# Altium schematic sheet Power.SchDoc
size A; SheetNumber: 3; SheetTotal: 7
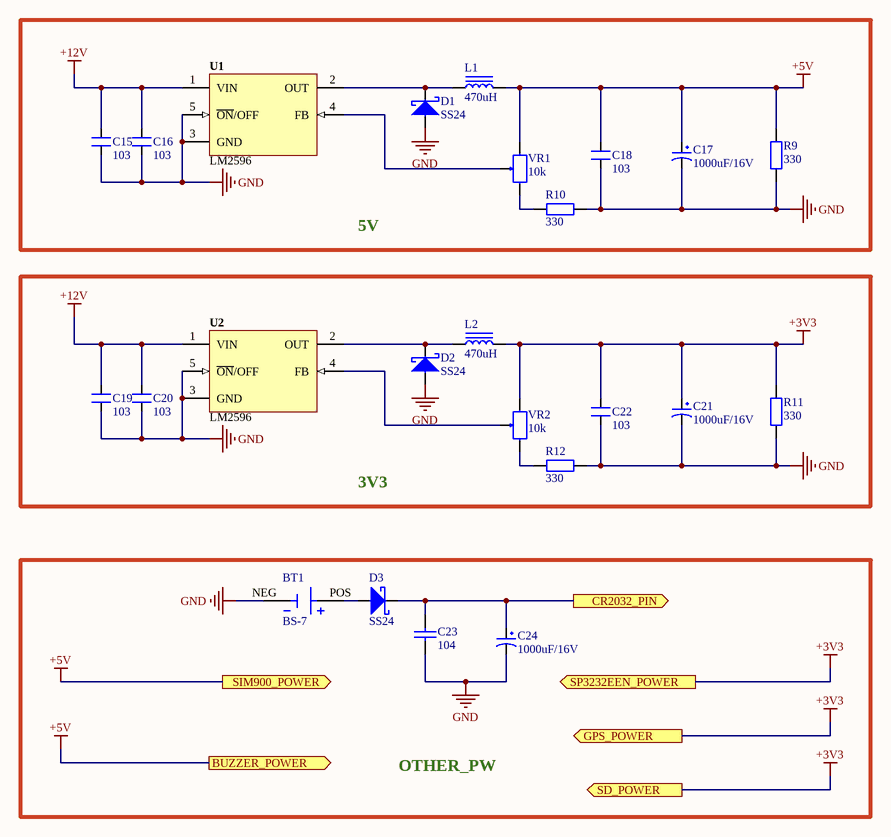
[diagram p0: Power.SchDoc]

## Parts
BT1  BS-7  [BAT_BS-7]
C15  103  [SM-0805]
C16  103  [SM-0603]
C17  1000uF/16V  [CP1.5/3.4]
C18  103  [SM-0603]
C19  103  [SM-0805]
C20  103  [SM-0603]
C21  1000uF/16V  [CP1.5/3.4]
C22  103  [SM-0603]
C23  104  [0805]
C24  1000uF/16V  [CP1.5/3.4]
D1  SS24  [DIO-SMD-106]
D2  SS24  [DIO-SMD-106]
D3  SS24  [DIO-SMD-106]
L1  470uH  [BOURNS SRR1280]
L2  470uH  [BOURNS SRR1280]
R9  330  [RES-1/4W]
R10  330  [RES-1/4W]
R11  330  [RES-1/4W]
R12  330  [RES-1/4W]
U1  LM2596  [TO263]
U2  LM2596  [TO263]
VR1  10k  [VR-S3]
VR2  10k  [VR-S3]

## Blocks framed on the sheet
5V: C15-C18 D1 L1 R9 R10 U1 VR1
3V3: C19-C22 D2 L2 R11 R12 U2 VR2
OTHER_PW: BT1 C23 C24 D3

## Ports
BUZZER_POWER (out), CR2032_PIN (out), GPS_POWER (out), SD_POWER (out), SIM900_POWER (out), SP3232EEN_POWER (out)

## Nets
+3V3: C21.1 C22.2 L2.2 R11.2 VR2.3 ; port SP3232EEN_POWER, port GPS_POWER, port SD_POWER
+5V: C17.1 C18.2 L1.2 R9.2 VR1.3 ; port SIM900_POWER, port BUZZER_POWER
+12V: C15.2 C16.2 C19.2 C20.2 U1.1(VIN) U2.1(VIN)
GND: BT1.NEG C15.1 C16.1 C17.2 C18.1 C19.1 C20.1 C21.2 C22.1 C23.1 C24.2 D1.1 D2.1 R9.1 R10.1 R11.1 R12.1 U1.3(GND) U1.5(~{ON}/OFF) U2.3(GND) U2.5(~{ON}/OFF)
CR2032_PIN: C23.2 C24.1 D3.2 ; port CR2032_PIN
NetBT1_POS: BT1.POS D3.1
NetD1_2: D1.2 L1.1 U1.2(OUT)
NetD2_2: D2.2 L2.1 U2.2(OUT)
NetR10_2: R10.2 VR1.1
NetR12_2: R12.2 VR2.1
NetU1_4: U1.4(FB) VR1.2
NetU2_4: U2.4(FB) VR2.2

## Library data of the parts
BT1 = BS-7: Battery Holder (Open) Coin, 20.0mm 1 Cell PC Pin; MF: MPD (Memory; SnapEDA_Link: https://www.snapeda.com/parts/BS-7/MPD+%2528Memory+Protection+Devices%2529/view-part/?ref=snap; Package: None; MP: BS-7; Check_prices: https://www.snapeda.com/parts/BS-7/MPD+%2528Memory+Protection+Devices%2529/view-part/?ref=eda; Purchase-URL: https://pricing.snapeda.com/search/part/BS-7/?ref=eda; Digi-Key_Part_Number: BS-7-ND; Value: *
C15 C16 C18-C20 C22 = CM: Cap SMD; Value: 103
C17 C21 C24 = CP4: Cap 1000uF/16V - 220uF/50V; Description 5: 4,7uF>10uF/250V_3,3uF>10uF/400V - 2,2uF>4,7uF/450V; Description 1: 2200uF-3300uF/6,3V - 1000uF-2200uF/10V; Description 2: 1000uF/16V - 470uF => 1000uF/25V - 100uF/100V; Description 3: 330uF>470uF/35V_220uF>470uF/50V_10uF>22uF/250V; Description 4: 220uF => 330uF/63V - 10uF =>33uF/160 - 200V; Value: 1000uF/16V
C23 = Cap 104_SMD: Capacitor (Semiconductor SIM Model); Value: 0.1uF; Published: 8-Jun-2000; LatestRevisionDate: 17-Jul-2002; LatestRevisionNote: Re-released for DXP Platform.; PackageReference: C1206; Publisher: Altium Limited
D1-D3 = Diode Schottky: Part Number: LED 3 ly Single Colour; Pricing: *
L1 L2 = Inductor: SMT Inductor; Value: 1.5uH
R9-R12 = R: Resistor R1/4W
U1 U2 = LM2596: Max Input Voltage: 12 V; Max Output Current: 3 (6.0 peak) A; Max Output Voltage: mV; Category: IC-Power; Min Input Voltage: mV; Min Output Voltage: mV; Mounting Technology: Surface Mount; Status: Unreleased; Supply Voltage: mV; Temperature Range: -40 to +125 degC
VR1 VR2 = Resistor Var